# EAGLE design atmegademo (EAGLE 6.5.0)
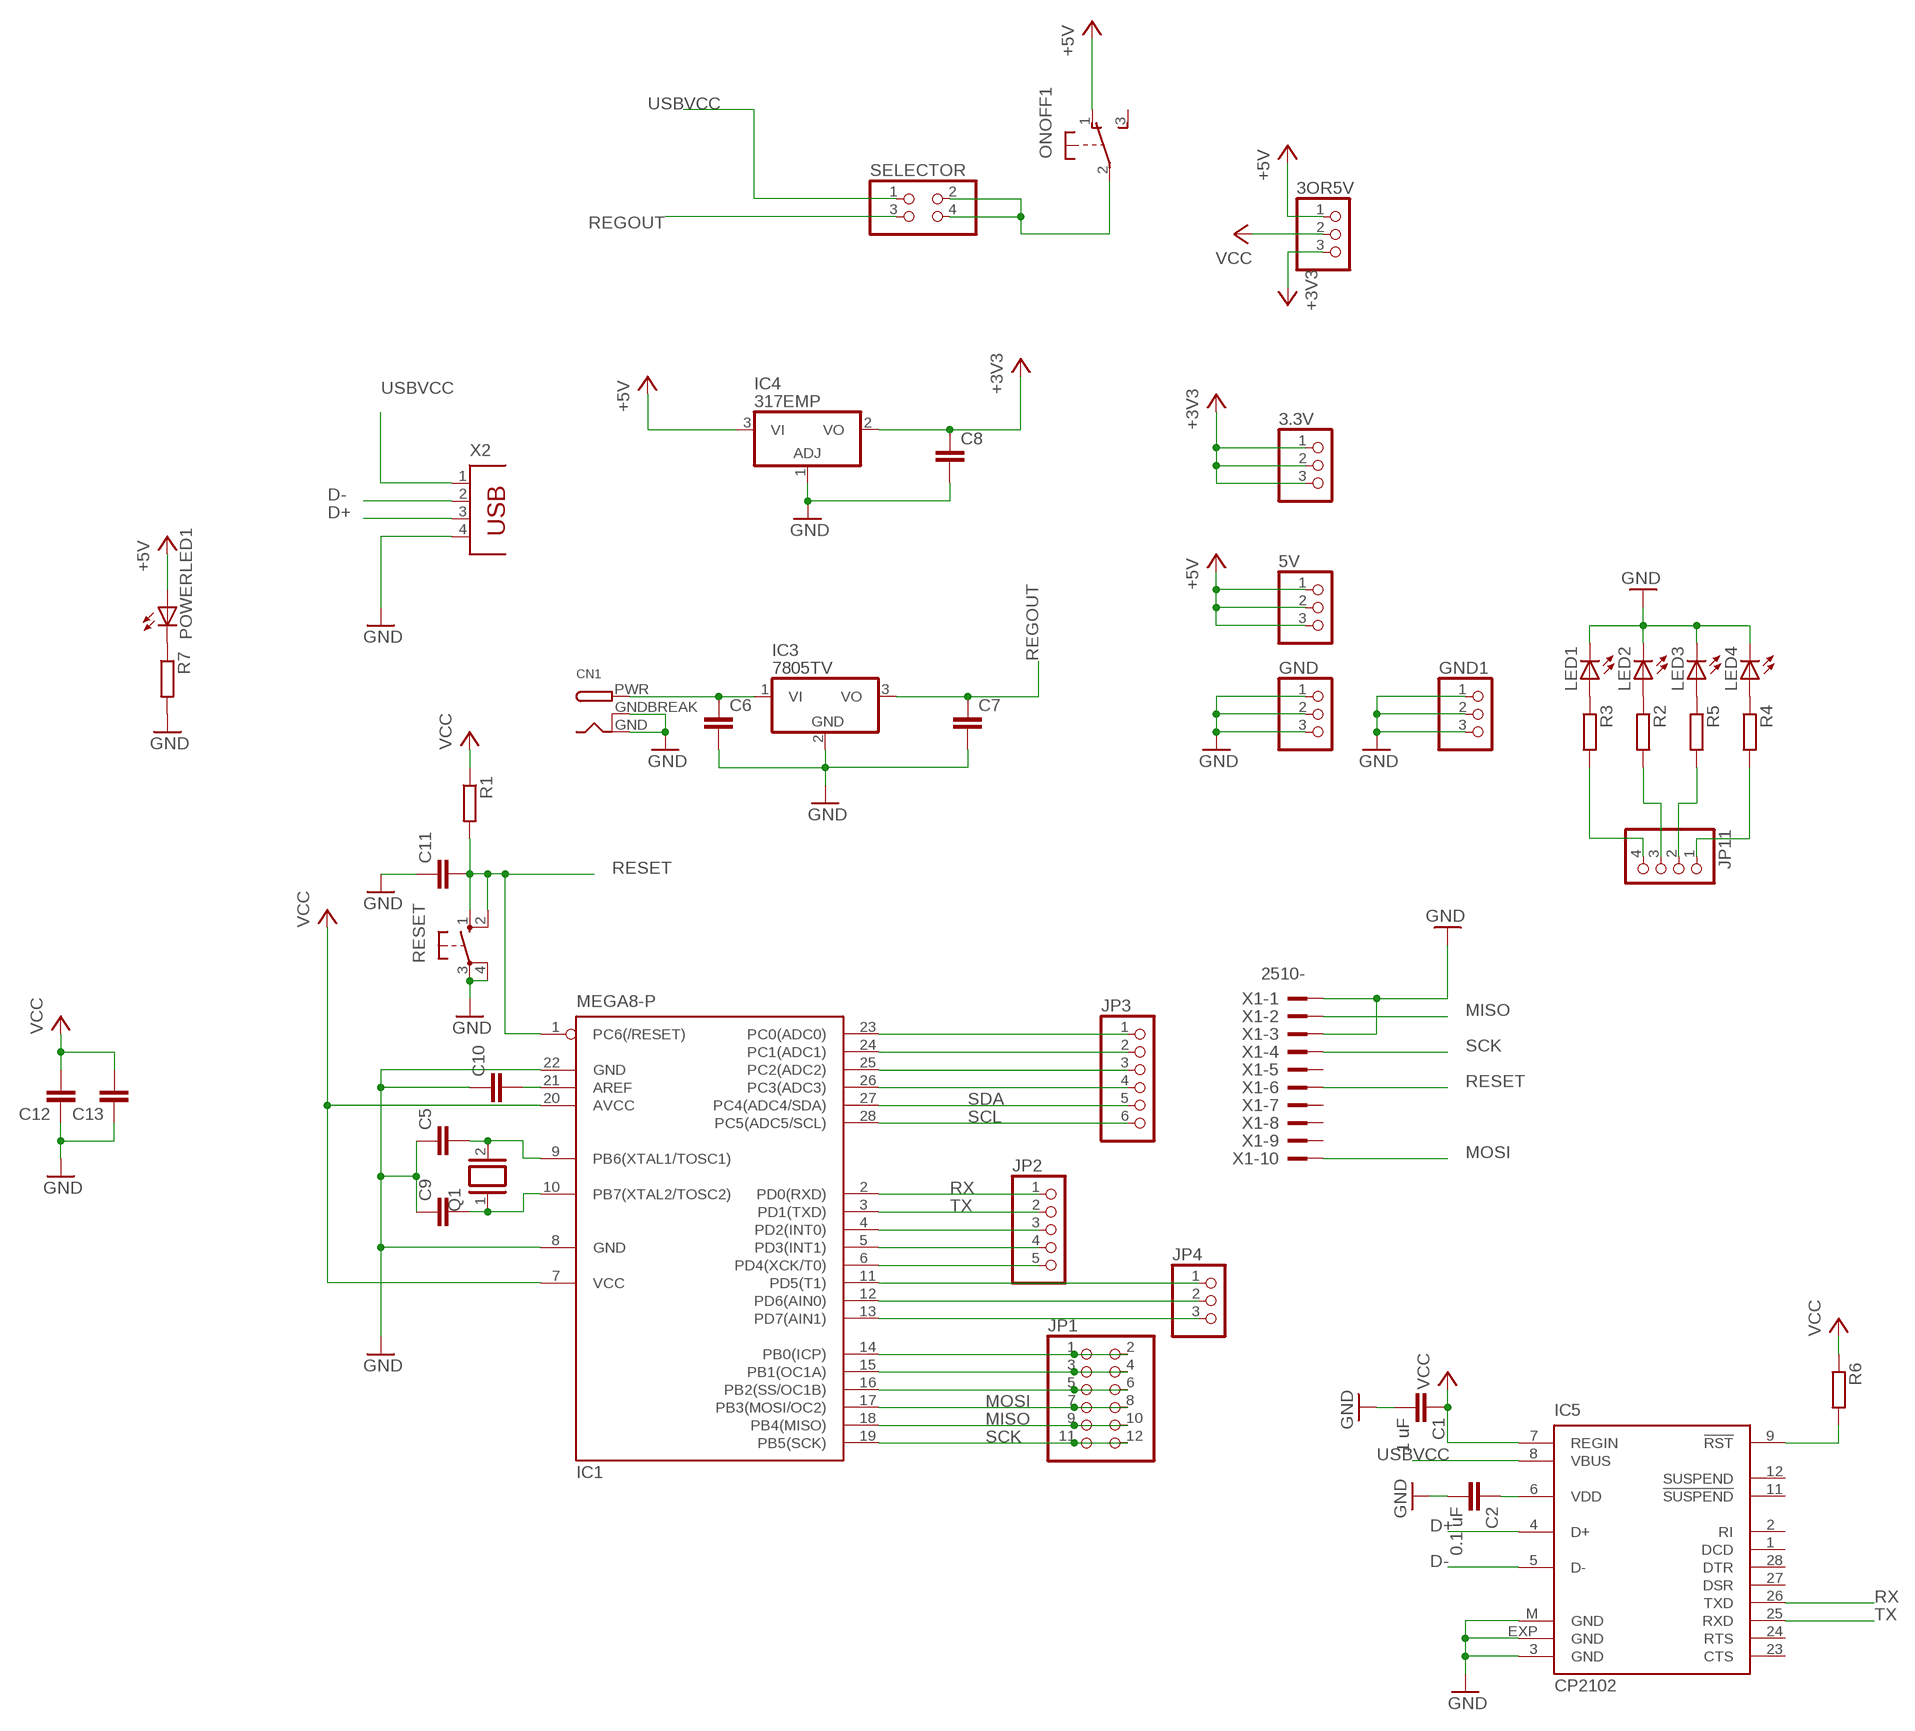
[diagram p0: schematic, sheet 1]

## Parts
3.3V  PINHD-1X3  [1X03]
3OR5V  PINHD-1X3  [1X03]
5V  PINHD-1X3  [1X03]
C1  1 uF  C-EUC0805K  [C0805K]
C2  0.1 uF  C-EUC0805K  [C0805K]
C5  C-EUC0805K  [C0805K]
C6  C-EUC0805K  [C0805K]
C7  C-EUC0805K  [C0805K]
C8  C-EUC0805K  [C0805K]
C9  C-EUC0805K  [C0805K]
C10  C-EUC0805K  [C0805K]
C11  C-EUC0805K  [C0805K]
C12  C-EUC0805K  [C0805K]
C13  C-EUC0805K  [C0805K]
CN1  DCBARRELPTH  [DCJACK_2MM_PTH]
GND  PINHD-1X3  [1X03]
GND1  PINHD-1X3  [1X03]
IC1  MEGA8-P  [DIL28-3]
IC3  7805TV  [TO220V]
IC4  317EMP  [SOT223]
IC5  CP2102  [MLP28]
JP1  PINHD-2X6  [2X06]
JP2  PINHD-1X5  [1X05]
JP3  PINHD-1X6  [1X06]
JP4  PINHD-1X3  [1X03]
JP11  PINHD-1X4  [1X04]
LED1  LEDCHIP-LED0805  [CHIP-LED0805]
LED2  LEDCHIP-LED0805  [CHIP-LED0805]
LED3  LEDCHIP-LED0805  [CHIP-LED0805]
LED4  LEDCHIP-LED0805  [CHIP-LED0805]
ONOFF  EG1213  [EG1213]
POWERLED1  LEDCHIP-LED0805  [CHIP-LED0805]
Q1  XTAL/S  [QS]
R1  R-EU_0207/12  [0207/12]
R2  R-EU_R0805  [R0805]
R3  R-EU_R0805  [R0805]
R4  R-EU_R0805  [R0805]
R5  R-EU_R0805  [R0805]
R6  R-EU_R0805  [R0805]
R7  R-EU_R0805  [R0805]
RESET  10-XX  [B3F-10XX]
SELECTOR  PINHD-2X2  [2X02]
X1  2510-  [PAK100/2500-10]
X2  PN61729  [PN61729]

## Nets
+3V3: 3.3V.1 3.3V.2 3.3V.3 3OR5V.3 C8.1 IC4.2(VO)
+5V: 3OR5V.1 5V.1 5V.2 5V.3 IC4.3(VI) ONOFF.1(1:O) POWERLED1.A
D+: IC5.4(D+) X2.3
D-: IC5.5(D-) X2.2
GND: C1.2 C2.2 C5.1 C6.2 C7.2 C8.2 C9.1 C10.1 C11.1 C12.1 C13.1 CN1.GND CN1.GNDBREAK GND1.1 GND1.2 GND1.3 GND.1 GND.2 GND.3 IC1.8(GND) IC1.22(GND) IC3.2(GND) IC4.1(ADJ) IC5.3(GND) IC5.EXP(GND) IC5.M(GND) LED1.C LED2.C LED3.C LED4.C R7.2 RESET.3(P) RESET.4(P1) X1.1 X1.3 X2.4
MISO: IC1.18(PB4(MISO)) JP1.9 JP1.10 X1.2
MOSI: IC1.17(PB3(MOSI/OC2)) JP1.7 JP1.8 X1.10
N$1: ONOFF.2(1:P) SELECTOR.2 SELECTOR.4
N$2: POWERLED1.C R7.1
N$3: C2.1 IC5.6(VDD)
N$4: IC5.9(!RST) R6.2
N$7: JP11.4 R3.2
N$10: JP11.3 R2.2
N$11: IC1.4(PD2(INT0)) JP2.3
N$12: IC1.5(PD3(INT1)) JP2.4
N$13: IC1.6(PD4(XCK/T0)) JP2.5
N$14: C6.1 CN1.PWR IC3.1(VI)
N$15: IC1.11(PD5(T1)) JP4.1
N$16: IC1.23(PC0(ADC0)) JP3.1
N$17: IC1.12(PD6(AIN0)) JP4.2
N$18: IC1.13(PD7(AIN1)) JP4.3
N$19: IC1.24(PC1(ADC1)) JP3.2
N$20: IC1.25(PC2(ADC2)) JP3.3
N$21: IC1.26(PC3(ADC3)) JP3.4
N$22: JP11.2 R5.2
N$23: LED1.A R3.1
N$24: LED2.A R2.1
N$26: C10.2 IC1.21(AREF)
N$27: C5.2 IC1.9(PB6(XTAL1/TOSC1)) Q1.2
N$28: LED4.A R4.1
N$29: LED3.A R5.1
N$30: C9.2 IC1.10(PB7(XTAL2/TOSC2)) Q1.1
N$31: IC1.15(PB1(OC1A)) JP1.3 JP1.4
N$32: IC1.16(PB2(SS/OC1B)) JP1.5 JP1.6
N$33: IC1.14(PB0(ICP)) JP1.1 JP1.2
N$36: JP11.1 R4.2
REGOUT: C7.1 IC3.3(VO) SELECTOR.3
RESET: C11.2 IC1.1(PC6(/RESET)) R1.2 RESET.1(S) RESET.2(S1) X1.6
RX: IC1.2(PD0(RXD)) IC5.26(TXD) JP2.1
SCK: IC1.19(PB5(SCK)) JP1.11 JP1.12 X1.4
SCL: IC1.28(PC5(ADC5/SCL)) JP3.6
SDA: IC1.27(PC4(ADC4/SDA)) JP3.5
TX: IC1.3(PD1(TXD)) IC5.25(RXD) JP2.2
USBVCC: IC5.8(VBUS) SELECTOR.1 X2.1
VCC: 3OR5V.2 C1.1 C12.2 C13.2 IC1.7(VCC) IC1.20(AVCC) IC5.7(REGIN) R1.1 R6.1
Unconnected: IC5.1(DCD) IC5.2(RI) IC5.11(!SUSPEND) IC5.12(SUSPEND) IC5.23(CTS) IC5.24(RTS) IC5.27(DSR) IC5.28(DTR) ONOFF.3(1:S) ONOFF.MT1(MT) ONOFF.MT2(MT) X1.5 X1.7 X1.8 X1.9

## Library data of the parts
3.3V 3OR5V 5V GND GND1 = adafruit:PINHD-1X3: PIN HEADER
C1 C2 C5-C13 = resistor:C-EU: CAPACITOR, European symbol
CN1 = adafruit:DCBARREL: 2.0mm DC Barrel Jack DCJACK_2MM_PTH - Through Hole Jack (4UConnector: 05537)
IC1 = atmel:MEGA8-P: MICROCONTROLLER 8 Kbytes FLASH, 1 kbytes SRAM, 512 bytes EEPROM, USART, 4-channel 10 bit ADC, 2-channel 8 bit ADC Pin compatible with Atmega48, ATMega88, ATMega168 Source: avr.lbr; OC_FARNELL: unknown; OC_NEWARK: unknown
IC3 = linear:78*: Positive VOLTAGE REGULATOR Source: http://cache.national.com/ds/LM/LM78L05.pdf http://www.fairchildsemi.com/ds/LM/LM7805.pdf
IC4 = linear:*317: Positive VOLTAGE REGULATOR
IC5 = silabs:CP210*: Single-Chip USB to UART Bridge Source: www.silabs.com .. CP2101.pdf / cp2102.pdf; MF: FARNELL; MPN: CP2102-GM; OC_FARNELL: 9282130; OC_NEWARK: 30K5635
JP1 = pinhead:PINHD-2X6: PIN HEADER
JP2 = pinhead:PINHD-1X5: PIN HEADER
JP3 = pinhead:PINHD-1X6: PIN HEADER
JP4 = pinhead:PINHD-1X3: PIN HEADER
JP11 = pinhead:PINHD-1X4: PIN HEADER
LED1-LED4 POWERLED1 = led:LED: LED OSRAM: - CHIPLED LG R971, LG N971, LY N971, LG Q971, LY Q971, LO R971, LY R971 LH N974, LH R974 LS Q976, LO Q976, LY Q976 LO Q996 - Hyper CHIPLED LW Q18S LB Q993, LB Q99A, LB R99A - SideLED LS A670, LO A670, LY A670, LG A670, LP A670 LB A673, LV A673, LT A673, LW A673 LH A674 LY A675 LS A676, LA A676, LO A676, LY A676, LW A676 LS A679, LY A679, LG A679 - Hyper Micro SIDELED® LS Y876, LA Y876, LO Y876, LY Y876 LT Y87S - SmartLED LW L88C, LW L88S LB L89C, LB L89S, LG L890 LS L89K, LO L89K, LY L89K LS L896, LA L896, LO L896, LY L896 - TOPLED LS T670, LO T670, LY T670, LG T670, LP T670 LSG T670, LSP T670, LSY T670, LOP T670, LYG T670 LG T671, LOG T671, LSG T671 LB T673, LV T673, LT T673, LW T673 LH T674 LS T676, LA T676, LO T676, LY T676, LB T676, LH T676, LSB T676, LW T676 LB T67C, LV T67C, LT T67C, LS T67K, LO T67K, LY T67K, LW E67C LS E67B, LA E67B, LO E67B, LY E67B, LB E67C, LV E67C, LT E67C LW T67C LS T679, LY T679, LG T679 LS T770, LO T770, LY T770, LG T770, LP T770 LB T773, LV T773, LT T773, LW T773 LH T774 LS E675, LA E675, LY E675, LS T675 LS T776, LA T776, LO T776, LY T776, LB T776 LHGB T686 LT T68C, LB T68C - Hyper Mini TOPLED® LB M676 - Mini TOPLED Santana® LG M470 LS M47K, LO M47K, LY M47K Source: http://www.osram.convergy.de LUXEON: - LUMILED® LXK2-PW12-R00, LXK2-PW12-S00, LXK2-PW14-U00, LXK2-PW14-V00 LXK2-PM12-R00, LXK2-PM12-S00, LXK2-PM14-U00 LXK2-PE12-Q00, LXK2-PE12-R00, LXK2-PE12-S00, LXK2-PE14-T00, LXK2-PE14-U00 LXK2-PB12-K00, LXK2-PB12-L00, LXK2-PB12-M00, LXK2-PB14-N00, LXK2-PB14-P00, LXK2-PB14-Q00 LXK2-PR12-L00, LXK2-PR12-M00, LXK2-PR14-Q00, LXK2-PR14-R00 LXK2-PD12-Q00, LXK2-PD12-R00, LXK2-PD12-S00 LXK2-PH12-R00, LXK2-PH12-S00 LXK2-PL12-P00, LXK2-PL12-Q00, LXK2-PL12-R00 Source: www.luxeon.com KINGBRIGHT: KA-3528ASYC Source: www.kingbright.com
ONOFF = adafruit:EG1213: E-Switch right-angle slide SPDT Part #EG1213 http://www.ladyada.net/library/eagle
Q1 = special:XTAL/S: CRYSTAL
R1-R7 = resistor:R-EU_: RESISTOR, European symbol
RESET = switch-omron:10-XX: OMRON SWITCH; MPN: B3F-1000; OC_FARNELL: 176432; OC_NEWARK: 36M3542
SELECTOR = pinhead:PINHD-2X2: PIN HEADER
X1 = con-3m:2510-: 3M (TM) Pak 100 4-Wall Header Source: 3M; MF: 3M; MPN: 2510-6002UB; OC_FARNELL: 9838244; OC_NEWARK: 46F4725
X2 = con-berg:PN61729: BERG USB connector; OC_FARNELL: unknown; OC_NEWARK: unknown

## Net classes
0 default: clearance 0.355 mm

## Board
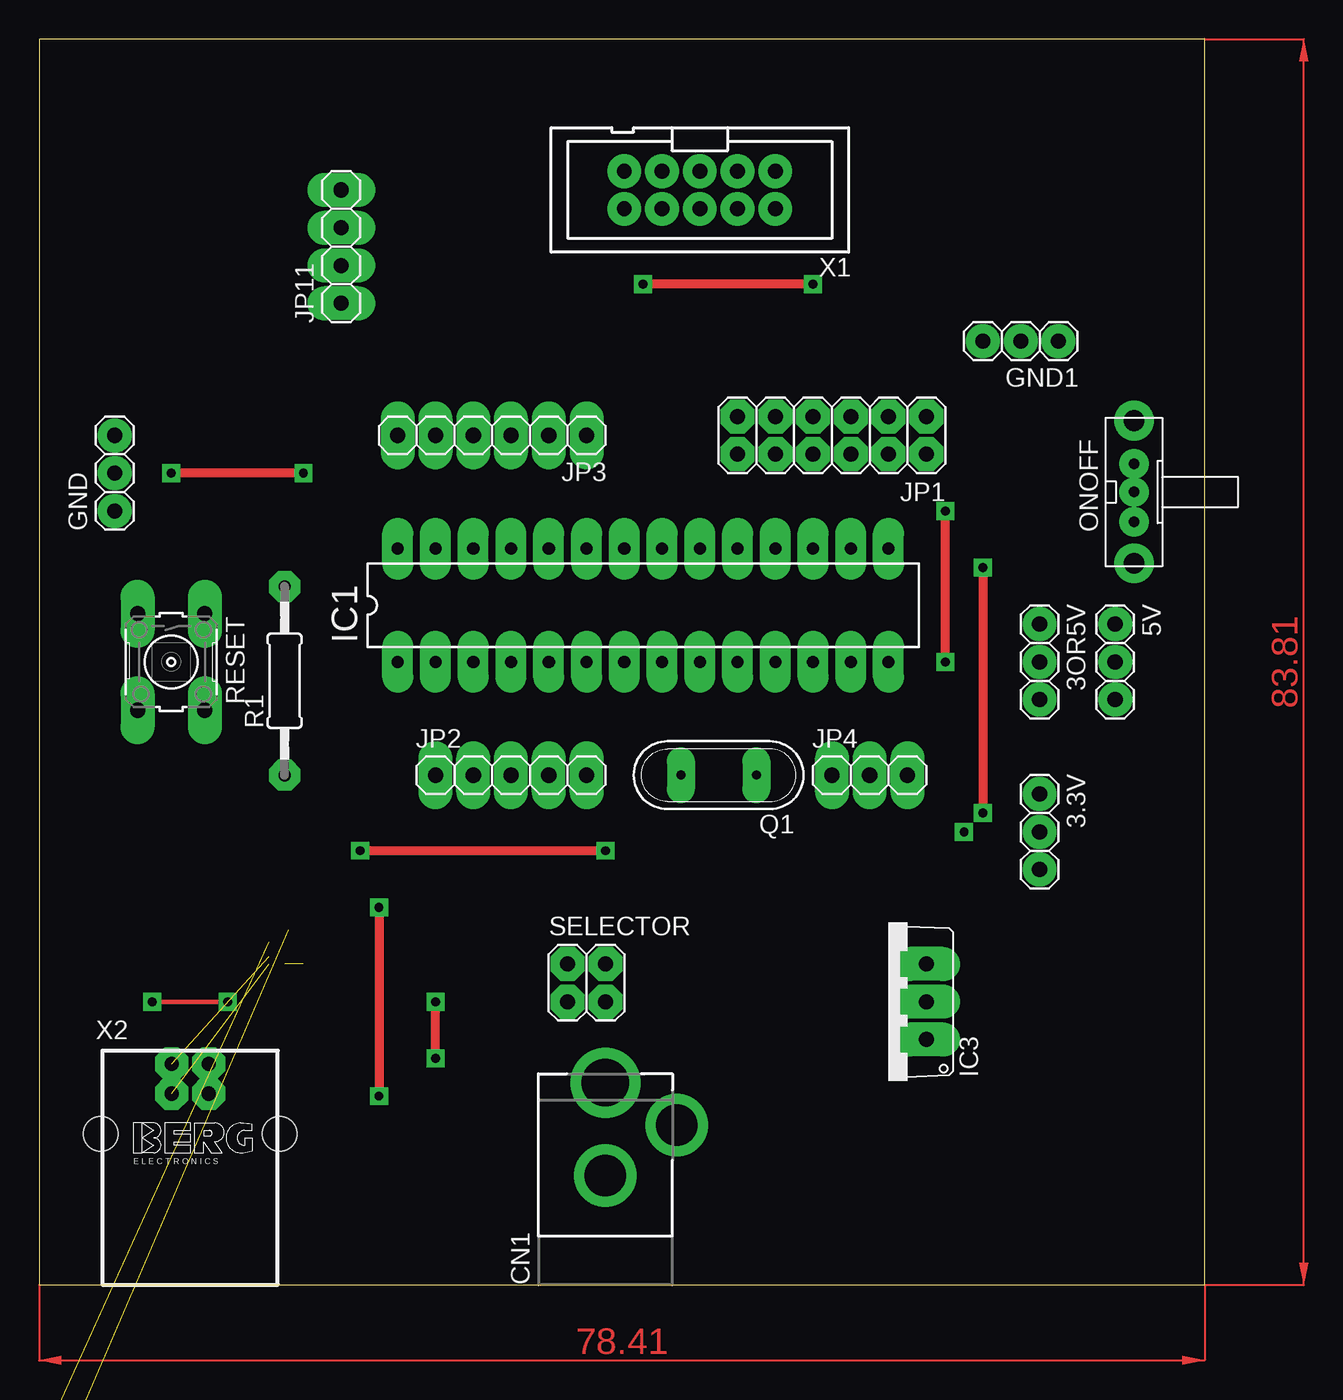
[diagram p1: board, top side]
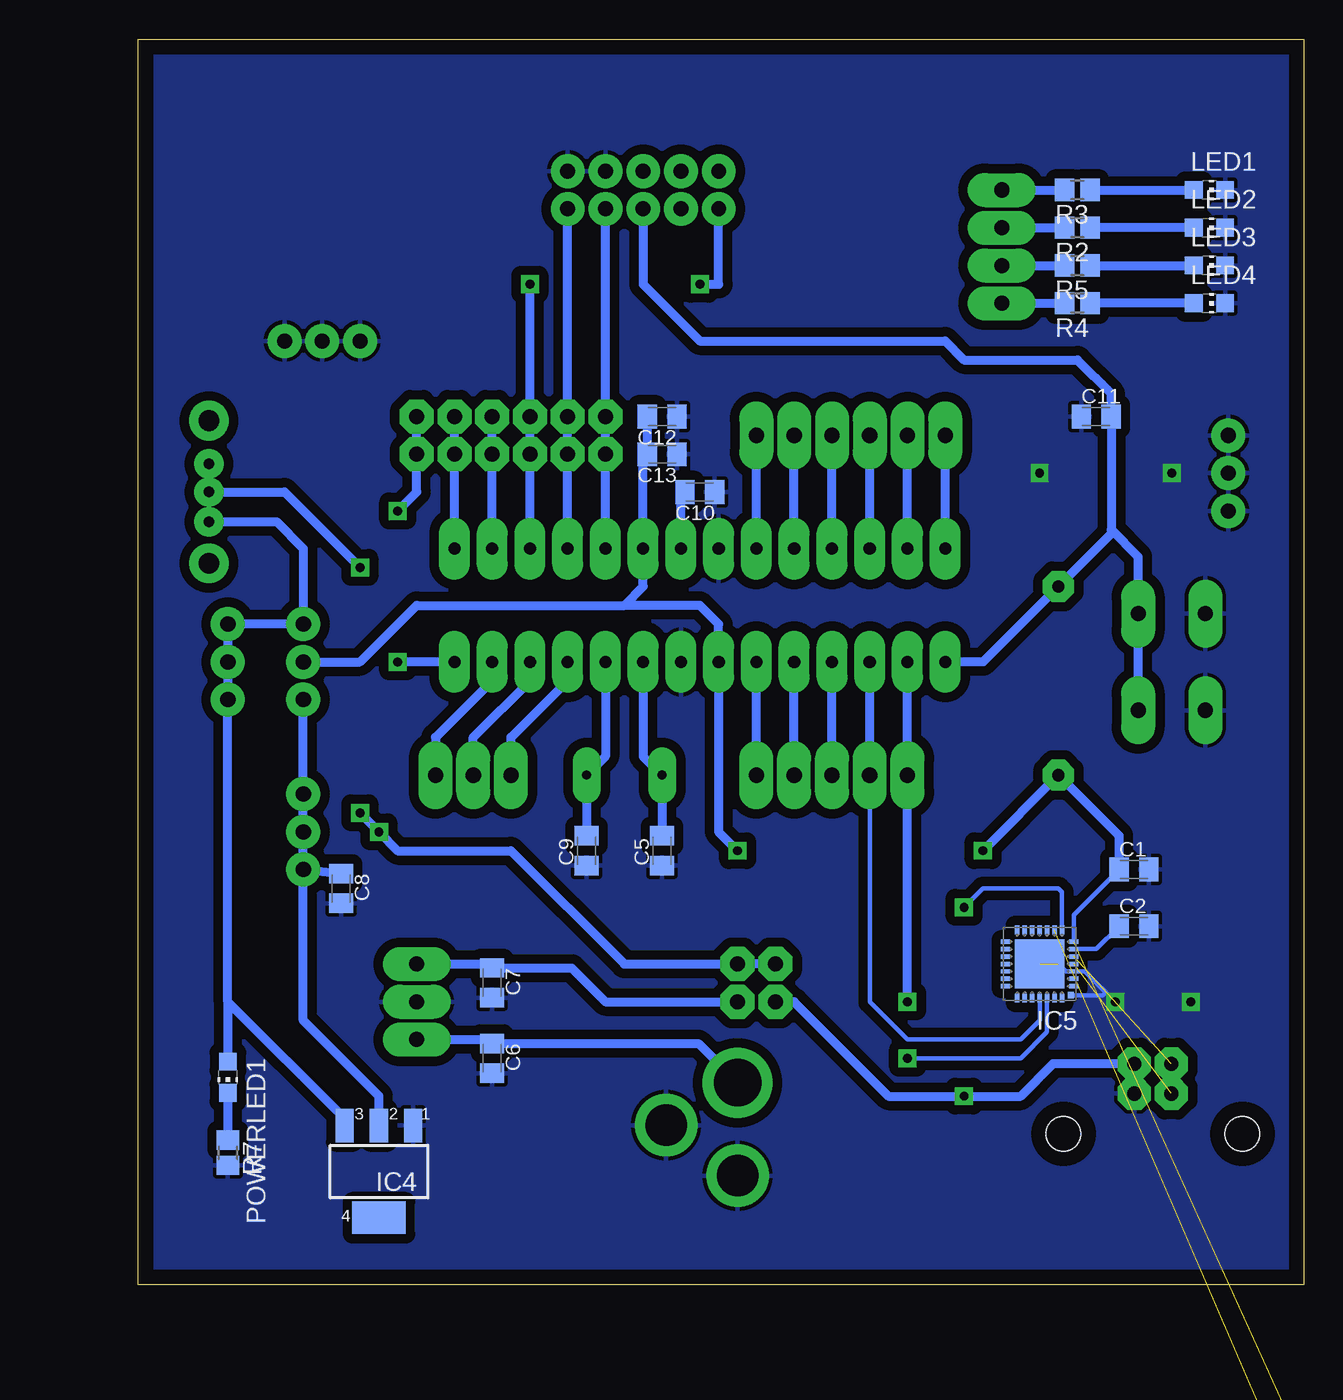
[diagram p2: board, bottom side, seen from below]

Size 78.41 x 83.81 mm. Coordinates in mm from the lower left corner, seen from the top.
Outline: 0,0 78.41,0 78.41,83.81 0,83.81 0,0
Copper layers (1*16): Top 0.035mm / dielectric 1.5mm / Bottom 0.035mm
Design rules "default": minimum track width 10mil, minimum drill 32mil, track to track 12mil, track to pad 12mil, pad to pad 12mil, via to via 12mil, smd to smd 8mil, copper to edge 40mil, drill to drill 40mil, minimum pad ring 25mil, minimum via ring 12mil, stop-mask expansion 4mil, vias tented up to drill 0mil, thermal gap 10mil

### Footprints (pad centres in the part's own frame; a part is rotated, then mirrored left to right if it is on the bottom)
1X03 = drill 1.016: 1 -2.54,0; 2 0,0; 3 2.54,0
C0805K = smd 1.3 x 1.6: 1 -1,0; 2 1,0
DCJACK_2MM_PTH = drill 2.8: GND 0,7.35; GNDBREAK 4.8,10.75 | drill 3.2: PWR 0,13.6
DIL28-3 = drill 0.813 long: 1 -16.51,-3.81; 2 -13.97,-3.81; 3 -11.43,-3.81; 4 -8.89,-3.81; 5 -6.35,-3.81; 6 -3.81,-3.81; 7 -1.27,-3.81; 8 1.27,-3.81; 9 3.81,-3.81; 10 6.35,-3.81; 11 8.89,-3.81; 12 11.43,-3.81; 13 13.97,-3.81; 14 16.51,-3.81; 15 16.51,3.81; 16 13.97,3.81; 17 11.43,3.81; 18 8.89,3.81; 19 6.35,3.81; 20 3.81,3.81; 21 1.27,3.81; 22 -1.27,3.81; 23 -3.81,3.81; 24 -6.35,3.81; 25 -8.89,3.81; 26 -11.43,3.81; 27 -13.97,3.81; 28 -16.51,3.81
TO220V = drill 1.016 long: 1 -2.54,-2.54; 2 0,-2.54; 3 2.54,-2.54
SOT223 = smd 1.219 x 2.235: 1 -2.311,-3.099; 2 0,-3.099; 3 2.311,-3.099 | smd 3.6 x 2.2: 4 0,3.099
MLP28 = smd 0.6 x 0.3: 1 -2.3,1.5; 2 -2.3,1; 3 -2.3,0.5; 4 -2.3,0; 5 -2.3,-0.5; 6 -2.3,-1; 7 -2.3,-1.5; 15 2.3,-1.5; 16 2.3,-1; 17 2.3,-0.5; 18 2.3,0; 19 2.3,0.5; 20 2.3,1; 21 2.3,1.5 | smd 0.3 x 0.6: 8 -1.5,-2.3; 9 -1,-2.3; 10 -0.5,-2.3; 11 0,-2.3; 12 0.5,-2.3; 13 1,-2.3; 14 1.5,-2.3; 22 1.5,2.3; 23 1,2.3; 24 0.5,2.3; 25 0,2.3; 26 -0.5,2.3; 27 -1,2.3; 28 -1.5,2.3 | smd 3.3 x 3.3: EXP 0,0 | smd 0.435 x 0.435: M -2.103,2.103
2X06 = drill 1.016 octagon: 1 -6.35,-1.27; 2 -6.35,1.27; 3 -3.81,-1.27; 4 -3.81,1.27; 5 -1.27,-1.27; 6 -1.27,1.27; 7 1.27,-1.27; 8 1.27,1.27; 9 3.81,-1.27; 10 3.81,1.27; 11 6.35,-1.27; 12 6.35,1.27
1X05 = drill 1.016 long: 1 -5.08,0; 2 -2.54,0; 3 0,0; 4 2.54,0; 5 5.08,0
1X06 = drill 1.016 long: 1 -6.35,0; 2 -3.81,0; 3 -1.27,0; 4 1.27,0; 5 3.81,0; 6 6.35,0
1X03' = drill 1.016 long: 1 -2.54,0; 2 0,0; 3 2.54,0
1X04 = drill 1.016 long: 1 -3.81,0; 2 -1.27,0; 3 1.27,0; 4 3.81,0
CHIP-LED0805 = smd 1.2 x 1.2: A 0,-1.05; C 0,1.05
EG1213 = drill 0.7 pad 1.422: 1 -2,0; 2 0,0; 3 1.9,0 | drill 1.4 pad 2.54: MT1 -4.8,0; MT2 4.8,0
QS = drill 0.61 long: 1 -2.54,0; 2 2.54,0
0207/12 = drill 0.813 octagon: 1 -6.35,0; 2 6.35,0
R0805 = smd 1.3 x 1.5: 1 -0.85,0; 2 0.85,0
B3F-10XX = drill 1.016 long: 1 -3.251,2.261; 2 3.251,2.261; 3 -3.251,-2.261; 4 3.251,-2.261
2X02 = drill 1.016 octagon: 1 -1.27,-1.27; 2 -1.27,1.27; 3 1.27,-1.27; 4 1.27,1.27
PAK100/2500-10 = drill 1 pad 1.422: 1 -5.08,-1.27; 2 -5.08,1.27; 3 -2.54,-1.27; 4 -2.54,1.27; 5 0,-1.27; 6 0,1.27; 7 2.54,-1.27; 8 2.54,1.27; 9 5.08,-1.27; 10 5.08,1.27
PN61729 = drill 0.95 octagon: 1 1.25,4.71; 2 -1.25,4.71; 3 -1.25,2.71; 4 1.25,2.71 | hole 2.3: -6.02,0; 6.02,0

### Placement (x,y rotation side)
3.3V  67.31,30.48 270 top
3OR5V  67.31,41.91 270 top
5V  72.39,41.91 270 top
C1  11.43,27.94 0 bottom
C2  11.43,24.13 0 bottom
C5  43.18,29.21 90 bottom
C6  54.61,15.24 270 bottom
C7  54.61,20.32 270 bottom
C8  64.77,26.67 270 bottom
C9  48.26,29.21 90 bottom
C10  40.64,53.34 180 bottom
C11  13.97,58.42 0 bottom
C12  43.18,58.42 180 bottom
C13  43.18,55.88 180 bottom
CN1  38.1,0 0 top
GND  5.08,54.61 90 top
GND1  66.04,63.5 180 top
IC1  40.64,45.72 0 top
IC3  57.15,19.05 90 top
IC4  62.23,7.62 180 bottom
IC5  17.78,21.59 180 bottom
JP1  53.34,57.15 180 top
JP2  31.75,34.29 0 top
JP3  30.48,57.15 180 top
JP4  [1X03']  55.88,34.29 0 top
JP11  20.32,69.85 90 top
LED1  6.35,73.66 270 bottom
LED2  6.35,71.12 270 bottom
LED3  6.35,68.58 270 bottom
LED4  6.35,66.04 270 bottom
ONOFF  73.66,53.34 90 top
POWERLED1  72.39,13.97 180 bottom
Q1  45.72,34.29 180 top
R1  16.51,40.64 90 top
R2  15.24,71.12 180 bottom
R3  15.24,73.66 180 bottom
R4  15.24,66.04 180 bottom
R5  15.24,68.58 180 bottom
R6  1.27,-10.16 0 top  (outside the outline)
R7  72.39,8.89 270 bottom
RESET  8.89,41.91 270 top
SELECTOR  36.83,20.32 0 top
X1  44.45,73.66 180 top
X2  10.16,10.16 0 top

### Tracks (layer width: path | path; a pad name or v marks a point on that pad's centre or on a via)
+3V3
  Bottom 0.61: 3.3V.3 C8.1 | IC4.2 62.23,12.7 67.31,17.78 3.3V.3 | 3.3V.3 3.3V.2 3.3V.1 3OR5V.3
+5V
  Bottom 0.61: IC4.3 64.54,11.2 72.39,19.05 | 72.39,19.05 5V.3 5V.2 5V.1 3OR5V.1 67.31,49.53 69.12,51.34 ONOFF.1 70.39,51.34 | 72.39,19.05 POWERLED1.A
D+  (1 unrouted)
D-  (1 unrouted)
GND  (via drill 0.6)  (1 unrouted)
  Top 0.305: v12.7,19.05 v7.62,19.05
  Top 0.61: v17.78,54.61 v8.89,54.61
  Bottom 0.305: 16.51,21.59 16.01,21.09 IC5.3 14.74,21.09 13.34,19.68 | 13.34,19.68 v12.7,19.05 | IC5.M 13.53,19.49 13.34,19.68
  pour Bottom (isolate 0.635): -1.27,83.82 77.47,83.82 77.47,-3.81 -1.27,-3.81
MISO
  Bottom 0.61: X1.2 JP1.9 JP1.10 IC1.18
MOSI  (via drill 0.6)
  Top 0.61: v52.07,67.31 v40.64,67.31
  Bottom 0.61: v52.07,67.31 JP1.7 JP1.8 IC1.17 | v40.64,67.31 39.37,67.31 X1.10
N$1  (via drill 0.6)
  Top 0.61: v63.5,48.26 v63.5,31.75
  Bottom 0.61: ONOFF.2 68.58,53.34 v63.5,48.26 | v63.5,31.75 v62.23,30.48 60.96,29.21 53.34,29.21 45.72,21.59 SELECTOR.4 SELECTOR.2
N$2
  Bottom 0.61: POWERLED1.C R7.1
N$3
  Bottom 0.305: IC5.6 13.97,22.59 C2.1
N$4  (1 unrouted)
N$7
  Bottom 0.61: JP11.4 R3.2
N$10
  Bottom 0.61: JP11.3 R2.2
N$11
  Bottom 0.61: JP2.3 IC1.4
N$12
  Bottom 0.61: JP2.4 IC1.5
N$13
  Bottom 0.61: JP2.5 IC1.6
N$14
  Bottom 0.61: IC3.1 54.88,16.51 C6.1 40.74,16.24 CN1.PWR
N$15
  Bottom 0.61: JP4.1 53.34,36.83 49.53,40.64 IC1.11
N$16
  Bottom 0.61: IC1.23 JP3.1
N$17
  Bottom 0.61: JP4.2 55.88,36.83 52.07,40.64 IC1.12
N$18
  Bottom 0.61: IC1.13 54.61,40.64 58.42,36.83 JP4.3
N$19
  Bottom 0.61: IC1.24 JP3.2
N$20
  Bottom 0.61: IC1.25 JP3.3
N$21
  Bottom 0.61: IC1.26 JP3.4
N$22
  Bottom 0.61: JP11.2 R5.2
N$23
  Bottom 0.61: R3.1 LED1.A
N$24
  Bottom 0.61: LED2.A R2.1
N$26
  Bottom 0.61: IC1.21 41.91,53.07 C10.2
N$27
  Bottom 0.61: IC1.9 44.45,35.56 Q1.2 C5.2
N$28
  Bottom 0.61: LED4.A R4.1
N$29
  Bottom 0.61: R5.1 LED3.A
N$30
  Bottom 0.61: IC1.10 46.99,35.56 Q1.1 C9.2
N$31
  Bottom 0.61: IC1.15 JP1.4 JP1.3
N$32
  Bottom 0.61: IC1.16 JP1.6 JP1.5
N$33  (via drill 0.6)
  Top 0.61: v60.96,41.91 v60.96,52.07
  Bottom 0.61: JP1.1 JP1.2 59.69,53.34 v60.96,52.07 | IC1.14 v60.96,41.91
N$36
  Bottom 0.61: JP11.1 R4.2
REGOUT
  Bottom 0.61: IC3.3 54.88,21.59 C7.1 49.26,21.32 46.99,19.05 SELECTOR.3
RESET
  Bottom 0.61: 12.97,50.8 C11.2 12.97,59.96 15.24,62.23 22.86,62.23 24.13,63.5 40.64,63.5 44.45,67.31 X1.6 | 12.97,50.8 12.97,50.53 R1.2 21.59,41.91 IC1.1 | RESET.2 RESET.1 11.15,48.98 12.97,50.8
RX  (via drill 0.6)
  Top 0.61: v26.67,15.24 v26.67,19.05
  Bottom 0.305: IC5.26 17.28,17.01 19.05,15.24 v26.67,15.24
  Bottom 0.61: v26.67,19.05 JP2.1 IC1.2
SCK
  Bottom 0.61: X1.4 JP1.11 JP1.12 IC1.19
SCL
  Bottom 0.61: IC1.28 JP3.6
SDA
  Bottom 0.61: IC1.27 JP3.5
TX
  Bottom 0.305: IC5.25 17.78,17.78 19.05,16.51 26.67,16.51 29.21,19.05 JP2.2
  Bottom 0.61: JP2.2 IC1.3
USBVCC  (via drill 0.6)
  Top 0.61: v22.86,25.4 v22.86,12.7
  Bottom 0.305: IC5.8 16.28,26.44 16.51,26.67 21.59,26.67 v22.86,25.4
  Bottom 0.61: X2.1 16.88,14.87 19.05,12.7 v22.86,12.7 27.94,12.7 34.29,19.05 SELECTOR.1
VCC  (via drill 0.6)  (1 unrouted)
  Top 0.61: v38.1,29.21 v21.59,29.21
  Bottom 0.305: IC5.7 15.48,24.89 C1.1
  Bottom 0.61: C1.1 12.43,30.21 R1.1 v21.59,29.21 | 3OR5V.2 63.5,41.91 59.69,45.72 45.72,45.72 | 45.72,45.72 44.45,46.99 IC1.20 44.45,55.61 C13.2 C12.2 | 45.72,45.72 40.64,45.72 39.37,44.45 IC1.7 39.37,30.48 v38.1,29.21
(copper drawn outside any net)
  shapes: Top area x2

### Text on the board
bRestrict: atmega *8 / 09/2013 / -= ch.br. =-